# EAGLE design Keypads (EAGLE 9.5.2)
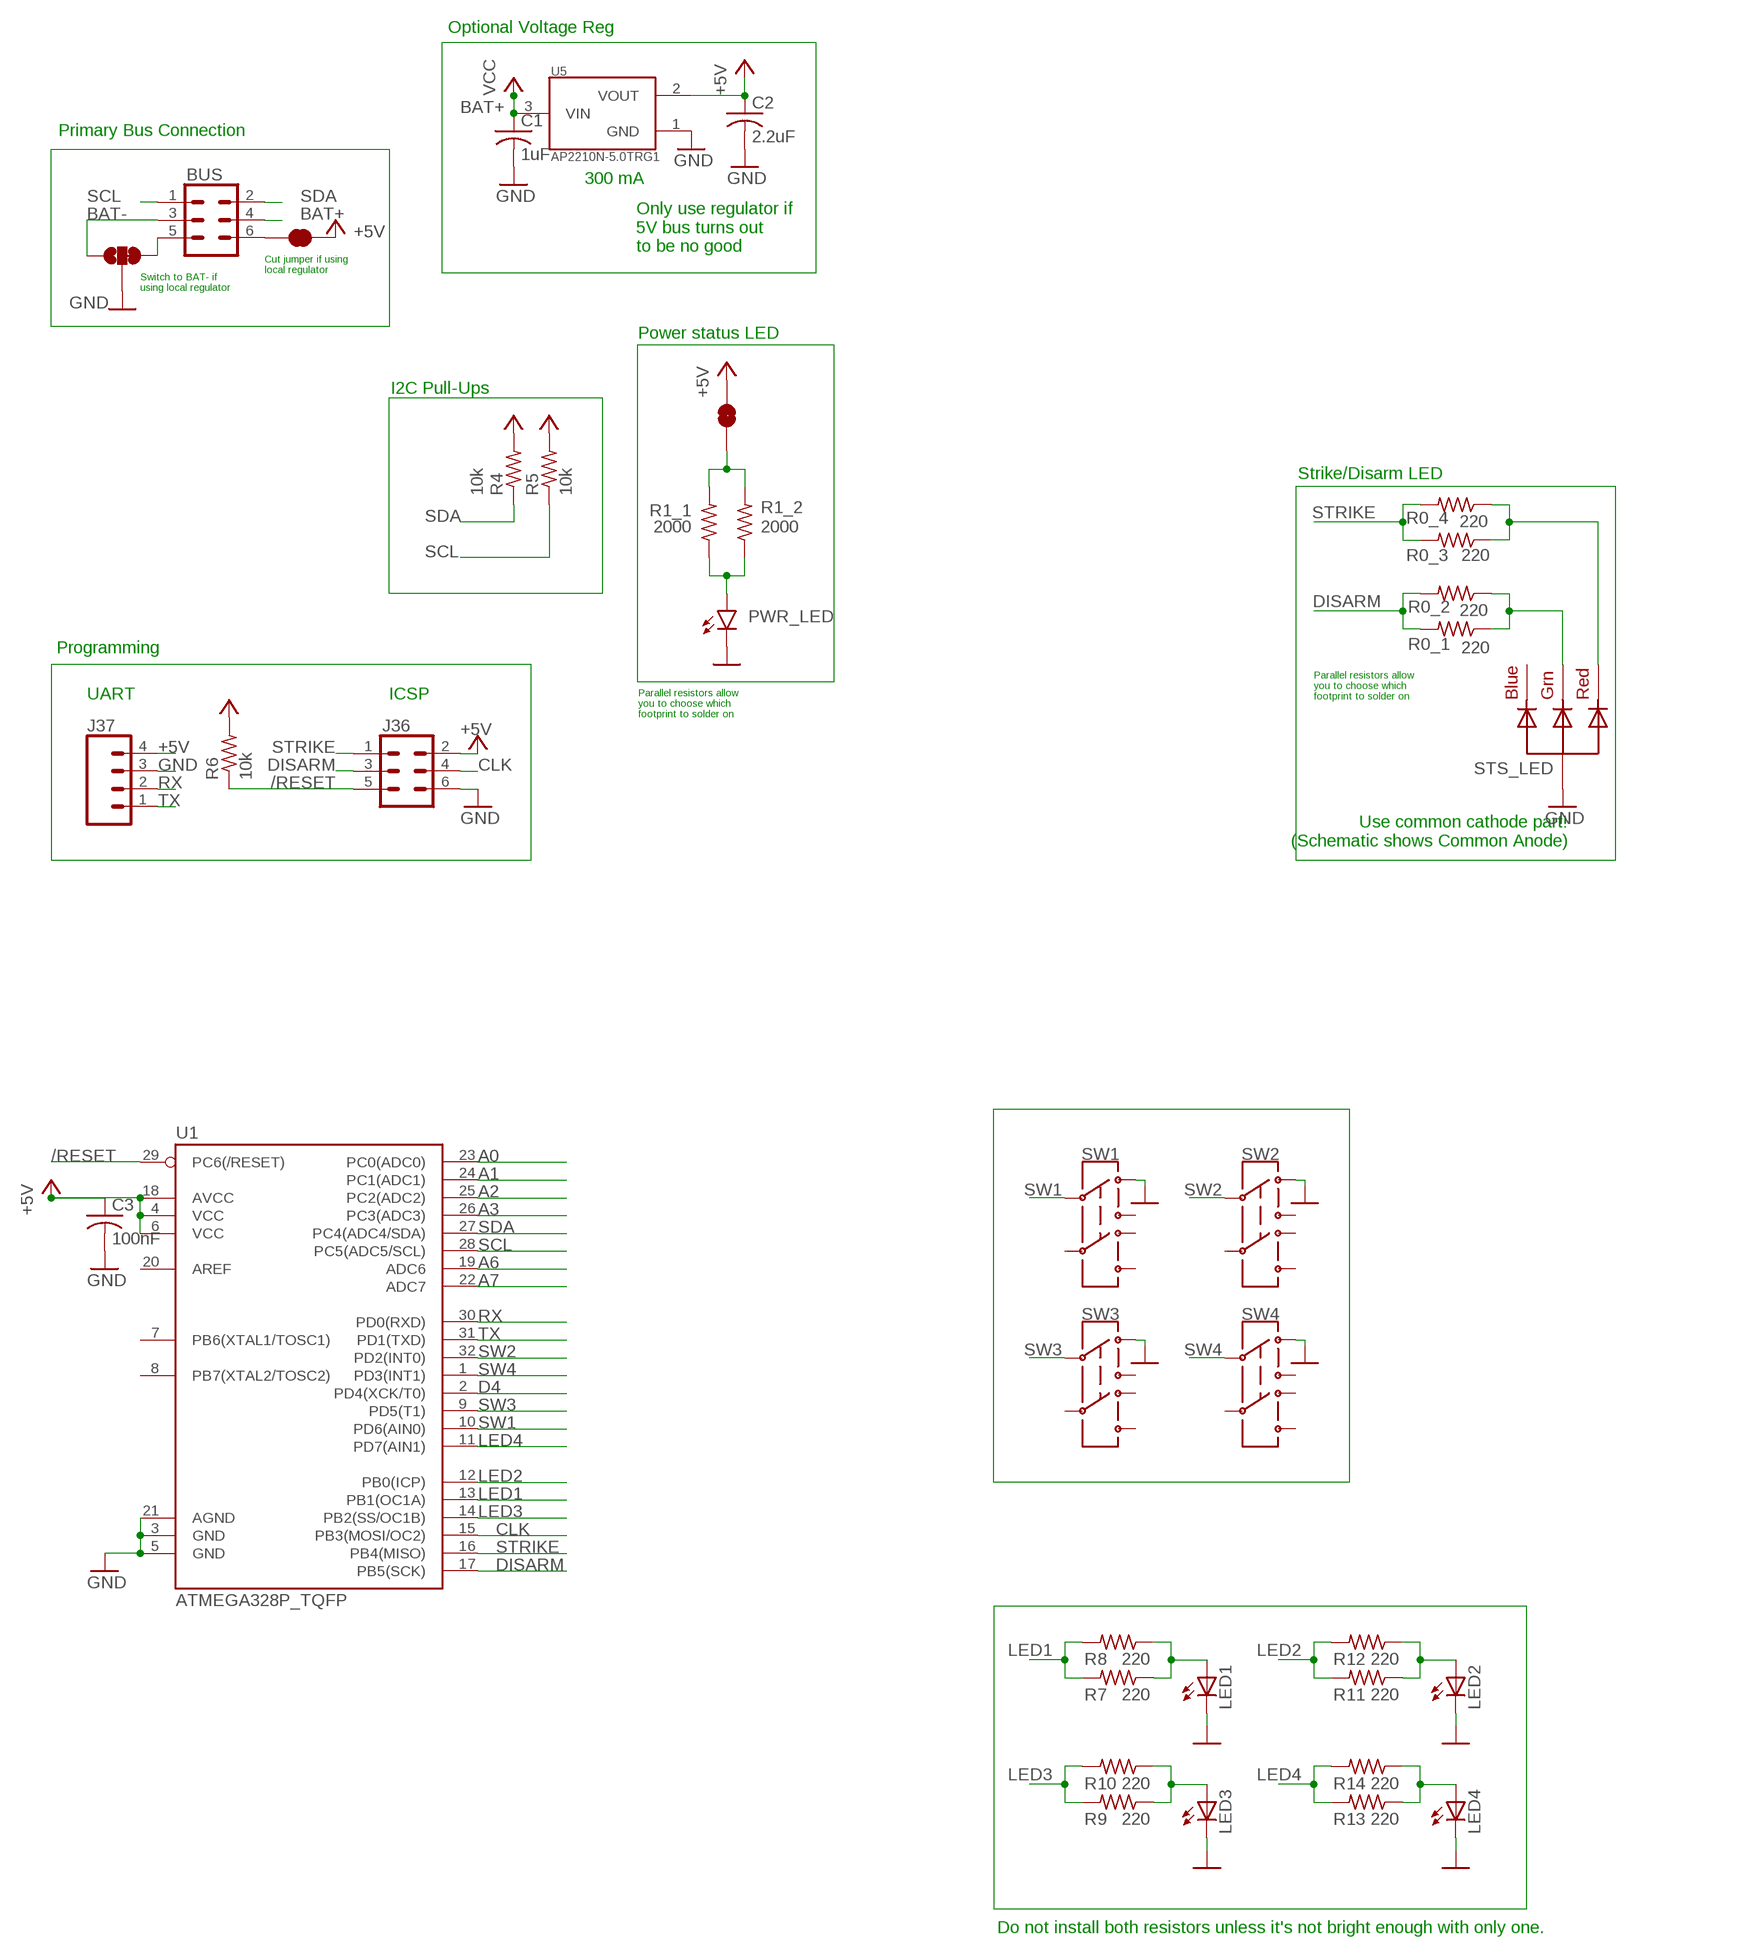
[diagram p0: schematic, sheet 1]

## Parts
BUS  CONN_03X2SHROUD  [2X3-SHROUDED]
C1  1uF  C-USC0805  [C0805]
C2  2.2uF  C-USC0805  [C0805]
C3  100nF  C-USC0805  [C0805]
J36  CONN_03X22X3_SILK_MALE_PTH  [2X3]
J37  CONN_04  [1X04]
JP1  JUMPER-SMT_2_NC_TRACE_SILK  [SMT-JUMPER_2_NC_TRACE_SILK]
JP2  JUMPER-SMT_3_1-NC_TRACE_SILK  [SMT-JUMPER_3_1-NC_TRACE_SILK]
JP3  JUMPER-SMT_2_NC_TRACE_SILK  [SMT-JUMPER_2_NC_TRACE_SILK]
LED1  LEDCHIP-LED0603  [CHIP-LED0603]
LED2  LEDCHIP-LED0603  [CHIP-LED0603]
LED3  LEDCHIP-LED0603  [CHIP-LED0603]
LED4  LEDCHIP-LED0603  [CHIP-LED0603]
PWR_LED  LED3MM  [LED_3MM]
R0_1  220  R-US_0204/7  [0204/7]
R0_2  220  R-US_R0805  [R0805]
R0_3  220  R-US_0204/7  [0204/7]
R0_4  220  R-US_R0805  [R0805]
R1_1  2000  R-US_0204/7  [0204/7]
R1_2  2000  R-US_R0805  [R0805]
R4  10k  R-US_0204/7  [0204/7]
R5  10k  R-US_0204/7  [0204/7]
R6  10k  R-US_0204/7  [0204/7]
R7  220  R-US_R0805  [R0805]
R8  220  R-US_R0805  [R0805]
R9  220  R-US_R0805  [R0805]
R10  220  R-US_R0805  [R0805]
R11  220  R-US_R0805  [R0805]
R12  220  R-US_R0805  [R0805]
R13  220  R-US_R0805  [R0805]
R14  220  R-US_R0805  [R0805]
STS_LED  RGBLED_CA-5MM  [LED5MMRGB]
SW1  MHPS2283N-SWITCH-PUSH-DPDT  [MHPS2283N]
SW2  MHPS2283N-SWITCH-PUSH-DPDT  [MHPS2283N]
SW3  MHPS2283N-SWITCH-PUSH-DPDT  [MHPS2283N]
SW4  MHPS2283N-SWITCH-PUSH-DPDT  [MHPS2283N]
U1  ATMEGA328P_TQFP  [TQFP32-08]
U5  AP2210N-5.0TRG1  [SOT95P280X145-3N]

## Nets
+5V: C2.1 C3.1 J36.2 J37.4 JP1.2 JP3.2 R4.2 R5.2 R6.2 U1.4(VCC) U1.6(VCC) U1.18(AVCC) U5.2(VOUT)
/RESET: J36.5 R6.1 U1.29(PC6(/RESET))
A0: U1.23(PC0(ADC0))
A1: U1.24(PC1(ADC1))
A2: U1.25(PC2(ADC2))
A3: U1.26(PC3(ADC3))
A6: U1.19(ADC6)
A7: U1.22(ADC7)
BAT+: BUS.4 C1.1 U5.3(VIN) ; supply symbol labelled VCC
BAT-: BUS.3 JP2.1
CLK: J36.4 U1.15(PB3(MOSI/OC2))
CONN_5V: BUS.6 JP1.1
CONN_GND: BUS.5 JP2.3
D4: U1.2(PD4(XCK/T0))
DISARM: J36.3 R0_1.2 R0_2.2 U1.17(PB5(SCK))
GND: C1.2 C2.2 C3.2 J36.6 J37.3 JP2.2 LED1.C LED2.C LED3.C LED4.C PWR_LED.K(C) STS_LED.2(VCC) SW1.P$1 SW2.P$1 SW3.P$1 SW4.P$1 U1.3(GND) U1.5(GND) U1.21(AGND) U5.1(GND)
LED1: R7.2 R8.2 U1.13(PB1(OC1A))
LED2: R11.2 R12.2 U1.12(PB0(ICP))
LED3: R9.2 R10.2 U1.14(PB2(SS/OC1B))
LED4: R13.2 R14.2 U1.11(PD7(AIN1))
N$2: PWR_LED.A R1_1.1 R1_2.1
N$3: JP3.1 R1_1.2 R1_2.2
N$5: LED3.A R9.1 R10.1
N$6: LED1.A R7.1 R8.1
N$7: LED2.A R11.1 R12.1
N$8: LED4.A R13.1 R14.1
N$11: R0_1.1 R0_2.1 STS_LED.3(GREEN)
N$12: R0_3.1 R0_4.1 STS_LED.1(RED)
RX: J37.2 U1.30(PD0(RXD))
SCL: BUS.1 R5.1 U1.28(PC5(ADC5/SCL))
SDA: BUS.2 R4.1 U1.27(PC4(ADC4/SDA))
STRIKE: J36.1 R0_3.2 R0_4.2 U1.16(PB4(MISO))
SW1: SW1.P$2 U1.10(PD6(AIN0))
SW2: SW2.P$2 U1.32(PD2(INT0))
SW3: SW3.P$2 U1.9(PD5(T1))
SW4: SW4.P$2 U1.1(PD3(INT1))
TX: J37.1 U1.31(PD1(TXD))
Unconnected: STS_LED.4(BLUE) SW1.P$3 SW1.P$4 SW1.P$5 SW1.P$6 SW2.P$3 SW2.P$4 SW2.P$5 SW2.P$6 SW3.P$3 SW3.P$4 SW3.P$5 SW3.P$6 SW4.P$3 SW4.P$4 SW4.P$5 SW4.P$6 U1.7(PB6(XTAL1/TOSC1)) U1.8(PB7(XTAL2/TOSC2)) U1.20(AREF)

## Notes on the sheet
- Optional Voltage Reg
- Primary Bus Connection
- 300 mA
- Only use regulator if 
  5V bus turns out 
  to be no good
- Cut jumper if using
  local regulator
- Switch to BAT- if
  using local regulator
- Power status LED
- I2C Pull-Ups
- Strike/Disarm LED
- Programming
- UART | ICSP
- Parallel resistors allow
  you to choose which
  footprint to solder on
- Parallel resistors allow
  you to choose which
  footprint to solder on
- Use common cathode part!
  (Schematic shows Common Anode)
- Do not install both resistors unless it's not bright enough with only one.

## Library data of the parts
BUS = SparkFun-Connectors:CONN_03X2: Multi connection point. Often used as Generic Header-pin footprint for 0.1 inch spaced/style header connections You can populate with any combo of single row headers, but if you'd like an exact match, check these: Header - 2x3 (Male, 0.1") <https://www.sparkfun.com/products/12807> (PRT-12807) Header - 2x3 (Female, 0.1") <https://www.sparkfun.com/products/13010> (PRT-13010) 2x3 Pin Shrouded Header <https://www.sparkfun.com/products/10877> (PRT-10877) On any of the 0.1 inch spaced packages, you can populate with these: Break Away Headers - Straight <https://www.sparkfun.com/products/116> (PRT-00116) Break Away Male Headers - Right Angle <https://www.sparkfun.com/products/553> (PRT-00553) Female Headers <https://www.sparkfun.com/products/115> (PRT-00115) Break Away Headers - Machine Pin <https://www.sparkfun.com/products/117> (PRT-00117) Break Away Female Headers - Swiss Machine Pin <https://www.sparkfun.com/products/743> (PRT-00743) Special note: the shrouded connector mates well with our 3x2 ribbon cables: Ribbon Crimp Connector - 6-pin (2x3, Female) <https://www.sparkfun.com/products/10651> (PRT-10651) Ribbon Cable - 6 wire (15ft) <https://www.sparkfun.com/products/10646> (PRT-10646); PROD_ID: CONN-10681; SF_ID: PRT_10877
C1-C3 = adafruit:C-US: CAPACITOR, American symbol
J36 = SparkFun-Connectors:CONN_03X2: Multi connection point. Often used as Generic Header-pin footprint for 0.1 inch spaced/style header connections You can populate with any combo of single row headers, but if you'd like an exact match, check these: Header - 2x3 (Male, 0.1") <https://www.sparkfun.com/products/12807> (PRT-12807) Header - 2x3 (Female, 0.1") <https://www.sparkfun.com/products/13010> (PRT-13010) 2x3 Pin Shrouded Header <https://www.sparkfun.com/products/10877> (PRT-10877) On any of the 0.1 inch spaced packages, you can populate with these: Break Away Headers - Straight <https://www.sparkfun.com/products/116> (PRT-00116) Break Away Male Headers - Right Angle <https://www.sparkfun.com/products/553> (PRT-00553) Female Headers <https://www.sparkfun.com/products/115> (PRT-00115) Break Away Headers - Machine Pin <https://www.sparkfun.com/products/117> (PRT-00117) Break Away Female Headers - Swiss Machine Pin <https://www.sparkfun.com/products/743> (PRT-00743) Special note: the shrouded connector mates well with our 3x2 ribbon cables: Ribbon Crimp Connector - 6-pin (2x3, Female) <https://www.sparkfun.com/products/10651> (PRT-10651) Ribbon Cable - 6 wire (15ft) <https://www.sparkfun.com/products/10646> (PRT-10646); PROD_ID: CONN-09701
J37 = SparkFun-Connectors:CONN_04: Multi connection point. Often used as Generic Header-pin footprint for 0.1 inch spaced/style header connections On any of the 0.1 inch spaced packages, you can populate with these: Break Away Headers - Straight <https://www.sparkfun.com/products/116> (PRT-00116) Break Away Male Headers - Right Angle <https://www.sparkfun.com/products/553> (PRT-00553) Female Headers <https://www.sparkfun.com/products/115> (PRT-00115) Break Away Headers - Machine Pin <https://www.sparkfun.com/products/117> (PRT-00117) Break Away Female Headers - Swiss Machine Pin <https://www.sparkfun.com/products/743> (PRT-00743) For SCREWTERMINALS and SPRING TERMINALS visit here: Screw Terimnals on SparkFun.com <https://www.sparkfun.com/search/results?term=Screw+Terminals> (5mm/3.5mm/2.54mm spacing) This device is also useful as a general connection point to wire up your design to another part of your project. Our various solder wires solder well into these plated through hole pads. Hook-Up Wire - Assortment (Stranded, 22 AWG) <https://www.sparkfun.com/products/11375> (PRT-11375) Hook-Up Wire - Assortment (Solid Core, 22 AWG) <https://www.sparkfun.com/products/11367> (PRT-11367) View the entire wire category on our website here <https://www.sparkfun.com/categories/141> Special notes: Molex polarized connector foot print use with SKU : PRT-08231 with associated crimp pins and housings. 1MM SMD Version SKU: PRT-10208; PROD_ID: CONN-09696
JP1 JP3 = SparkFun-Jumpers:JUMPER-SMT_2_NC_TRACE: Normally closed trace jumper This jumper has a trace between two pads so it's normally closed (NC). Use a razor knife to open the connection. For best results follow the IPC guidelines for cutting traces: Cutout at least 0.063 mm (0.005 in). Remove all loose material to clean up the cut area. Seal the cut with an approved epoxy. Reapply solder to reclose the connection.
JP2 = SparkFun-Jumpers:JUMPER-SMT_3_1-NC_TRACE: Normally closed trace jumper (1 of 2 connections) This jumper has a trace between two pads so it's normally closed (NC). The other connection is normally open (NO). Use a razor knife to open the connection. For best results follow the IPC guidelines for cutting traces: Cutout at least 0.063 mm (0.005 in). Remove all loose material to clean up the cut area. Seal the cut with an approved epoxy. Reapply solder to reclose the connection, or to close the NO connection.
LED1-LED4 = adafruit:LED: LED OSRAM: - CHIPLED LG R971, LG N971, LY N971, LG Q971, LY Q971, LO R971, LY R971 LH N974, LH R974 LS Q976, LO Q976, LY Q976 LO Q996 - Hyper CHIPLED LW Q18S LB Q993, LB Q99A, LB R99A - SideLED LS A670, LO A670, LY A670, LG A670, LP A670 LB A673, LV A673, LT A673, LW A673 LH A674 LY A675 LS A676, LA A676, LO A676, LY A676, LW A676 LS A679, LY A679, LG A679 - Hyper Micro SIDELED® LS Y876, LA Y876, LO Y876, LY Y876 LT Y87S - SmartLED LW L88C, LW L88S LB L89C, LB L89S, LG L890 LS L89K, LO L89K, LY L89K LS L896, LA L896, LO L896, LY L896 - TOPLED LS T670, LO T670, LY T670, LG T670, LP T670 LSG T670, LSP T670, LSY T670, LOP T670, LYG T670 LG T671, LOG T671, LSG T671 LB T673, LV T673, LT T673, LW T673 LH T674 LS T676, LA T676, LO T676, LY T676, LB T676, LH T676, LSB T676, LW T676 LB T67C, LV T67C, LT T67C, LS T67K, LO T67K, LY T67K, LW E67C LS E67B, LA E67B, LO E67B, LY E67B, LB E67C, LV E67C, LT E67C LW T67C LS T679, LY T679, LG T679 LS T770, LO T770, LY T770, LG T770, LP T770 LB T773, LV T773, LT T773, LW T773 LH T774 LS E675, LA E675, LY E675, LS T675 LS T776, LA T776, LO T776, LY T776, LB T776 LHGB T686 LT T68C, LB T68C - Hyper Mini TOPLED® LB M676 - Mini TOPLED Santana® LG M470 LS M47K, LO M47K, LY M47K Source: http://www.osram.convergy.de/
PWR_LED = SparkFun-LED:LED: LED (Generic) Standard schematic elements and footprints for 5mm, 3mm, 1206, and 0603 sized LEDs. Generic LEDs with no color specified.; PROD_ID: DIO-08794
R0_1-R0_4 R1_1 R1_2 R4-R14 = adafruit:R-US_: RESISTOR, American symbol
STS_LED = adafruit:RGBLED_CA: RGB LED, common-anode 5MM Staggered pins 5mm Piranha package http://www.ladyada.net/library/pcb/eaglelibrary.html
SW1-SW4 = MyLibrary:MHPS2283N-SWITCH-PUSH-DPDT
U1 = SparkFun-IC-Microcontroller:ATMEGA328P_TQFP: Popular 328P in QFP Storefront component: ATmega328 - TQFP <https://www.sparkfun.com/products/13448> (COM-13448) Datasheet <http://www.sparkfun.com/datasheets/Components/SMD/ATMega328.pdf> SparkFun Products SparkFun RedBoard - Programmed with Arduino <https://www.sparkfun.com/products/12757> (DEV-12757) Arduino Pro Mini 328 - 5V/16MHz <https://www.sparkfun.com/products/11113> (DEV-11113) Arduino Pro Mini 328 - 3.3V/8MHz <https://www.sparkfun.com/products/11114> (DEV-11114) SparkFun OpenLog <https://www.sparkfun.com/products/13712> (DEV-13712) SparkFun MicroView - OLED Arduino Module <https://www.sparkfun.com/products/12923> (DEV-12923) SparkFun Digital Sandbox <https://www.sparkfun.com/products/12651> (DEV-12651) SparkFun PicoBoard <https://www.sparkfun.com/products/11888> (WIG-11888) Arduino Fio <https://www.sparkfun.com/products/10116> (DEV-10116) LilyPad Arduino 328 Main Board <https://www.sparkfun.com/products/13342> (DEV-13342) SparkFun RedStick <https://www.sparkfun.com/products/13741> (DEV-13741) LilyPad MP3 <https://www.sparkfun.com/products/11013> (DEV-11013) LilyPad Arduino SimpleSnap <https://www.sparkfun.com/products/10941> (DEV-10941) SparkFun Stepoko <https://www.sparkfun.com/products/13899> (ROB-13899) SparkFun Geiger Counter <https://www.sparkfun.com/products/11345> (SEN-11345) SparkFun EL Sequencer <https://www.sparkfun.com/products/12781> (COM-12781) Arduino Pro 328 - 5V/16MHz <https://www.sparkfun.com/products/10915> (DEV-10915) CryptoCape <https://www.sparkfun.com/products/12773> (DEV-12773) SparkFun IR Thermometer Evaluation Board - MLX90614 <https://www.sparkfun.com/products/10740> (SEN-10740) SparkFun RedBot Mainboard <https://www.sparkfun.com/products/12097> (ROB-12097) Arduino Pro 328 - 3.3V/8MHz <https://www.sparkfun.com/products/10914> (DEV-10914) SparkFun Block for Intel® Edison - Arduino <https://www.sparkfun.com/products/13036> (DEV-13036) SparkFun Simon Says - Surface Mount Soldering Kit <https://www.sparkfun.com/products/10935> (KIT-10935) SparkFun 7-Segment Serial Display - Red <https://www.sparkfun.com/products/11441> (COM-11441) SparkFun 7-Segment Serial Display - White <https://www.sparkfun.com/products/11629> (COM-11629) SparkFun 7-Segment Serial Display - Yellow <https://www.sparkfun.com/products/11443> (COM-11443) SparkFun 7-Segment Serial Display - Kelly Green <https://www.sparkfun.com/products/11440> (COM-11440) SparkFun 7-Segment Serial Display - Blue <https://www.sparkfun.com/products/11442> (COM-11442) SparkFun OpenSegment Serial Display - 20mm (Blue) <https://www.sparkfun.com/products/11647> (COM-11647) SparkFun OpenSegment Serial Display - 20mm (Green) <https://www.sparkfun.com/products/11646> (COM-11646) SparkFun OpenSegment Serial Display - 20mm (White) <https://www.sparkfun.com/products/11648> (COM-11648) SparkFun OpenSegment Serial Display - 20mm (Red) <https://www.sparkfun.com/products/11644> (COM-11644) SparkFun OpenSegment Serial Display - 20mm (Yellow) <https://www.sparkfun.com/products/11645> (COM-11645) SparkFun OpenSegment Shield <https://www.sparkfun.com/products/13190> (DEV-13190); PROD_ID: IC-09069
U5 = AP2210N-5.0TRG1:AP2210N-5.0TRG1: LDO Regulator Pos 5V 0.3A 3-Pin SOT-23 T/R; DESCRIPTION: Linear Voltage Regulator IC 1 Output 300mA SOT-23-3; DIGI-KEY_PART_NUMBER: AP2210N-5.0TRG1DICT-ND; MF: Diodes Inc.; MP: AP2210N-5.0TRG1; PACKAGE: SOT-23 Diodes Inc.; PURCHASE-URL: https://pricing.snapeda.com/search/part/AP2210N-5.0TRG1/?ref=eda

## Board
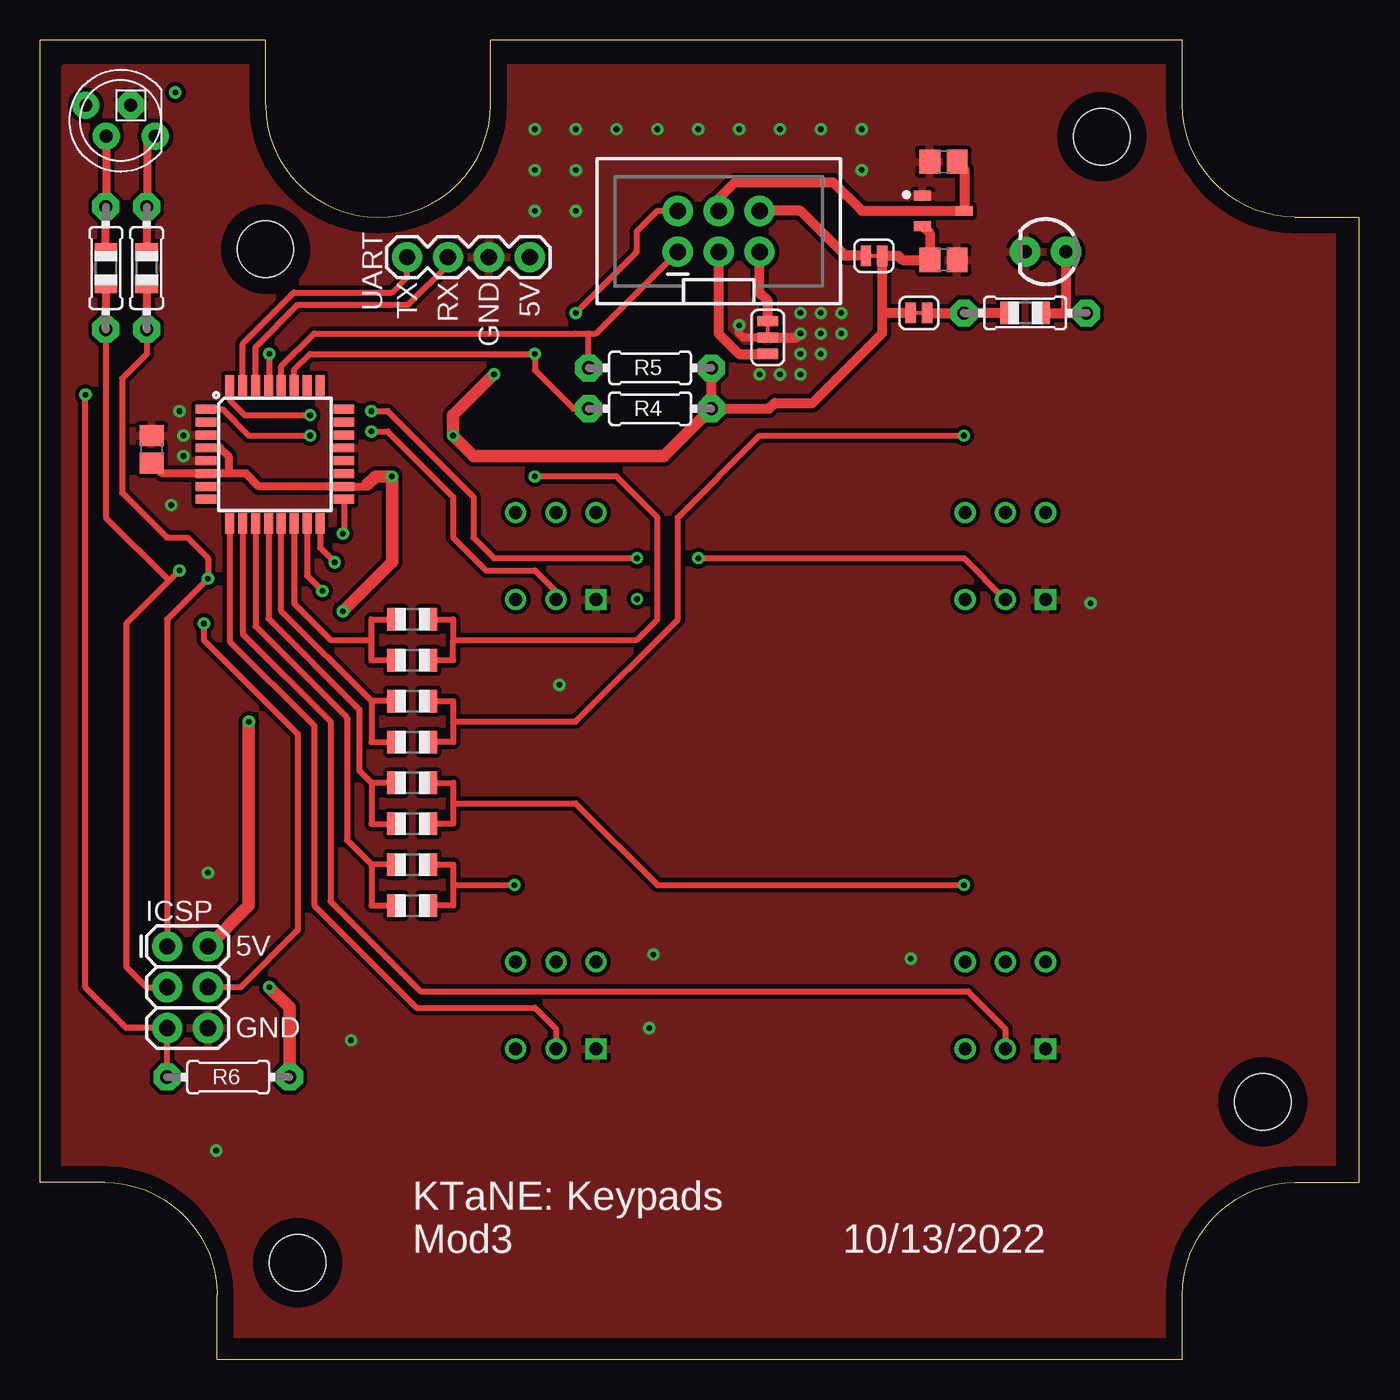
[diagram p1: board, top side]
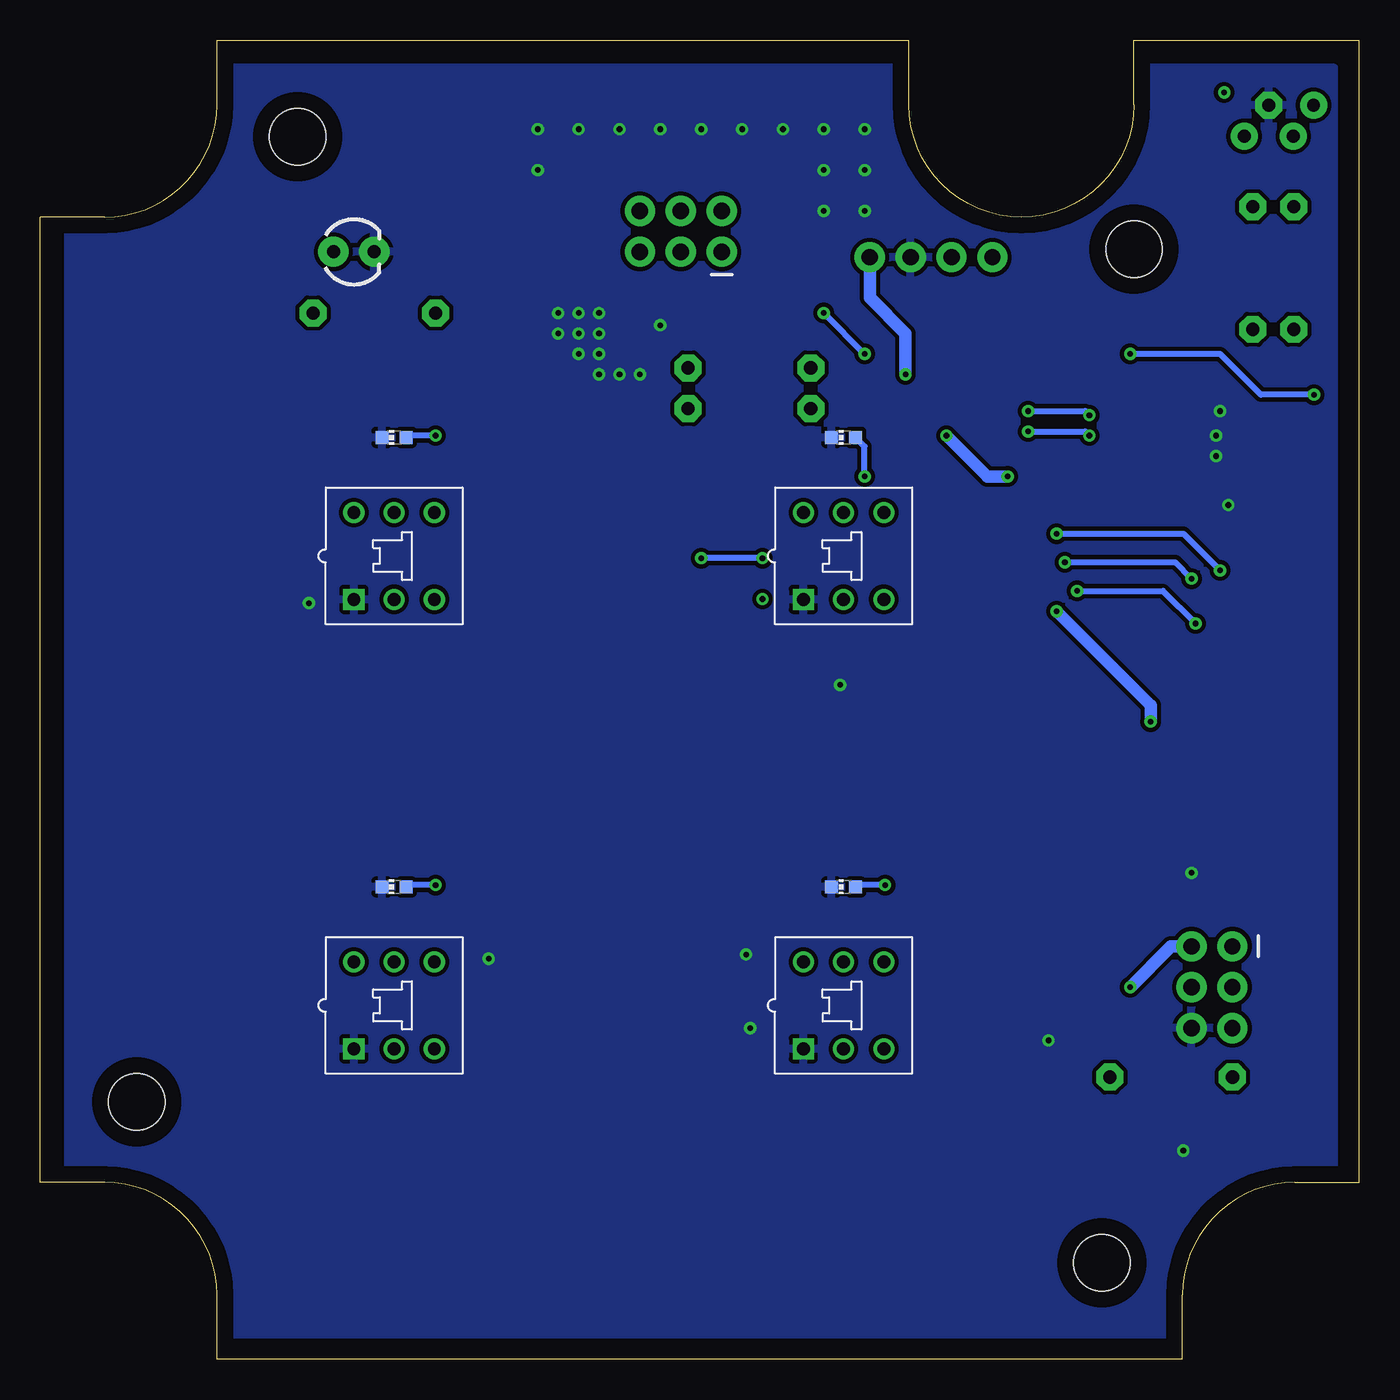
[diagram p2: board, bottom side, seen from below]

Size 82 x 82 mm. Coordinates in mm from the lower left corner, seen from the top.
Outline: 82,11 82,71 78,71 arc-90 71,78 71,82 28,82 28,78 arc-180 14,78 14,82 0,82 0,11 4,11 arc-90 11,4 11,0 71,0 71,4 arc-90 78,11 82,11
Copper layers (1*16): Top 0.035mm / dielectric 1.5mm / Bottom 0.035mm
Design rules "default *": minimum track width 6mil, minimum drill 0.35mm, track to track 6mil, track to pad 6mil, pad to pad 6mil, via to via 6mil, smd to smd 6mil, copper to edge 40mil, drill to drill 6mil, minimum pad ring 10mil, minimum via ring 8mil, stop-mask expansion 4mil, vias tented up to drill 0mil, thermal gap 10mil
Holes 3.5 mm at 16,6 76,16 66,76 14,69

### Footprints (pad centres in the part's own frame; a part is rotated, then mirrored left to right if it is on the bottom)
2X3-SHROUDED = drill 1.016 pad 1.88: 1 -1.27,2.54; 2 1.27,2.54; 3 -1.27,0; 4 1.27,0; 5 -1.27,-2.54; 6 1.27,-2.54
C0805 = smd 1.3 x 1.5: 1 -0.85,0; 2 0.85,0
2X3 = drill 1.016 pad 1.88: 1 0,0; 2 0,2.54; 3 2.54,0; 4 2.54,2.54; 5 5.08,0; 6 5.08,2.54
1X04 = drill 1.016 pad 1.88: 1 0,0; 2 2.54,0; 3 5.08,0; 4 7.62,0
SMT-JUMPER_2_NC_TRACE_SILK = smd 0.635 x 1.27: 1 -0.508,0; 2 0.508,0
SMT-JUMPER_3_1-NC_TRACE_SILK = smd 0.635 x 1.27: 1 -1.016,0; 2 0,0; 3 1.016,0
CHIP-LED0603 = smd 0.8 x 0.8: A 0,-0.75; C 0,0.75
LED_3MM = drill 0.813 pad 1.88: A -1.27,0; K 1.27,0
0204/7 = drill 0.813 pad 1.676 octagon: 1 -3.81,0; 2 3.81,0
R0805 = smd 1.1 x 1.4: 1 -1,0; 2 1,0
LED5MMRGB = drill 0.8 pad 1.676: 1 -2.159,0.968; 3 0.889,0.968; 4 2.159,-0.968 | drill 0.8 pad 1.676 octagon: 2 -0.635,-0.968
MHPS2283N = drill 0.8 square: P$1 -2.5,-2.7 | drill 0.8: P$2 0,-2.7; P$3 2.5,-2.7; P$4 2.5,2.7; P$5 0,2.7; P$6 -2.5,2.7
TQFP32-08 = smd 1.27 x 0.559: 1 -4.293,2.8; 2 -4.293,2; 3 -4.293,1.2; 4 -4.293,0.4; 5 -4.293,-0.4; 6 -4.293,-1.2; 7 -4.293,-2; 8 -4.293,-2.8; 17 4.293,-2.8; 18 4.293,-2; 19 4.293,-1.2; 20 4.293,-0.4; 21 4.293,0.4; 22 4.293,1.2; 23 4.293,2; 24 4.293,2.8 | smd 0.559 x 1.27: 9 -2.8,-4.293; 10 -2,-4.293; 11 -1.2,-4.293; 12 -0.4,-4.293; 13 0.4,-4.293; 14 1.2,-4.293; 15 2,-4.293; 16 2.8,-4.293; 25 2.8,4.293; 26 2,4.293; 27 1.2,4.293; 28 0.4,4.293; 29 -0.4,4.293; 30 -1.2,4.293; 31 -2,4.293; 32 -2.8,4.293
SOT95P280X145-3N = smd 1.05 x 0.6: 1 -1.3,0.95; 2 -1.3,-0.95; 3 1.3,0

### Placement (x,y rotation side)
BUS  42.18,70.12 90 top
C1  56.15,74.44 180 top
C2  56.15,68.34 0 top
C3  6.93,56.57 90 top
J36  7.89,25.67 270 top
J37  22.81,68.51 0 top
JP1  51.83,68.6 0 top
JP2  45.23,63.52 90 top
JP3  54.63,65.04 180 top
LED1  60,57.31 90 bottom
LED2  60,29.37 90 bottom
LED3  32.06,57.31 90 bottom
LED4  32.06,29.37 90 bottom
PWR_LED  62.5,68.85 180 top
R0_1  4.08,67.83 270 top
R0_2  4.08,67.83 270 top
R0_3  6.62,67.83 270 top
R0_4  6.62,67.83 270 top
R1_1  61.23,65.04 180 top
R1_2  61.23,65.04 180 top
R4  37.91,59.09 0 top
R5  37.91,61.63 0 top
R6  11.69,17.54 0 top
R7  23.13,38.37 180 top
R8  23.13,40.91 180 top
R9  23.13,45.99 180 top
R10  23.13,43.45 180 top
R11  23.13,35.83 180 top
R12  23.13,33.29 180 top
R13  23.13,28.21 180 top
R14  23.13,30.75 180 top
STS_LED  5,77 180 top
SW1  60,22 0 bottom
SW2  60,49.94 0 bottom
SW3  32.06,22 0 bottom
SW4  32.06,49.94 0 bottom
U1  14.59,56.26 0 top
U5  56.15,71.39 0 top

### Tracks (layer width: path | path; a pad name or v marks a point on that pad's centre or on a via)
+5V  (via drill 0.35)
  Top 0.508: 20.34,54.37 20.22,54.26 U1.18 13.59,54.26 12.79,55.06 11.7,55.06 | 11.7,55.06 U1.6 7.58,55.06 C3.1 | U1.4 11.19,56.66 11.7,56.15 11.7,55.06
  Top 0.635: 52.34,65.04 JP1.2 53.36,68.6 53.61,68.34 C2.1 55.3,69.99 U5.2 | 52.34,65.04 52.34,63.77 48.02,59.45 45.68,59.45 45.31,59.09 R4.2 R5.2 | JP3.2 52.34,65.04
  Top 0.762: R4.2 38.78,56.15 26.94,56.15 v25.67,57.42 25.67,58.69 v28.21,61.23 | 20.34,54.37 20.84,54.88 v21.86,54.88 21.86,49.55 v18.81,46.5 | v12.97,39.64 12.97,28.21 J36.2 | v14.24,23.13 15.5,21.87 R6.2
  Bottom 0.762: v25.67,57.42 23.13,54.88 v21.86,54.88 | v18.81,46.5 12.97,40.66 v12.97,39.64 | J36.2 11.7,25.67 v14.24,23.13 | v28.21,61.23 28.21,63.77 30.43,65.99 J37.4
/RESET  (via drill 0.35)
  Top 0.381: R6.1 J36.5 5.35,20.59 2.81,23.13 v2.81,59.96 | v14.24,62.5 14.24,60.6 U1.29
  Bottom 0.381: v2.81,59.96 6.11,59.96 8.65,62.5 v14.24,62.5
BAT+
  Top 0.635: BUS.4 42.18,72.15 43.2,73.17 49.29,73.17 51.07,71.39 U5.3 57.45,73.99 C1.1
BAT-
  Top 0.635: JP2.1 43.45,62.5 42.18,63.77 BUS.3
CLK  (via drill 0.35)
  Top 0.381: U1.15 16.59,48.72 v17.54,47.77 | v10.18,45.74 10.18,44.72 16.02,38.88 16.02,26.69 12.46,23.13 J36.4
  Bottom 0.381: v17.54,47.77 12.21,47.77 v10.18,45.74
CONN_5V
  Top 0.635: JP1.1 50.05,68.6 47.26,71.39 BUS.6
CONN_GND
  Top 0.635: JP2.3 45.23,65.8 44.72,66.31 BUS.5
DISARM  (via drill 0.35)
  Top 0.381: U1.17 18.88,51.4 v18.81,51.32 | v8.65,49.04 8.02,48.4 | 8.02,48.4 5.35,45.74 5.35,24.4 6.62,23.13 J36.3 | R0_1.2 4.08,52.34 8.02,48.4
  Top 0.508: R0_2.2 R0_1.2
  Bottom 0.381: v18.81,51.32 10.94,51.32 v8.65,49.04
GND  (via drill 0.35)
  Top 0.508: JP2.2 43.7,63.52 43.45,63.77 v43.45,64.28
  Top 0.635: JP2.2 47.01,63.52 v47.26,63.77
  other vias: 8.65,58.94 8.91,57.42 8.91,56.15 47.26,65.04 48.53,65.04 49.8,65.04 49.8,63.77 48.53,63.77 48.53,62.5 47.26,62.5 47.26,61.23 45.99,61.23 44.72,61.23 33.29,71.39 30.75,71.39 30.75,73.93 33.29,73.93 30.75,76.47 33.29,76.47 35.83,76.47 38.37,76.47 40.91,76.47 43.45,76.47 45.99,76.47 48.53,76.47 51.07,76.47 51.07,73.93 8.14,53.1 10.43,30.24 19.32,19.83 10.94,12.97 37.86,20.59 38.12,25.16 54.12,24.91 65.29,47.01 32.27,41.93
  pour Bottom (isolate 0.254): 1.54,80.28 80.28,80.28 80.28,1.54 1.54,1.54
  pour Top (isolate 0.254): 1.54,80.28 80.28,80.28 80.28,1.54 1.54,1.54
LED1
  Top 0.381: R8.2 20.59,40.91 | 20.59,40.91 20.59,38.37 R7.2 | 20.59,40.91 14.99,46.51 U1.13
LED2
  Top 0.381: R11.2 20.59,35.83 | 20.59,35.83 20.59,33.29 R12.2 | U1.12 14.19,46.04 19.83,40.4 19.83,36.59 20.59,35.83
LED3
  Top 0.381: R10.2 20.59,43.45 20.59,44.72 | 20.59,44.72 20.59,45.99 R9.2 | U1.14 15.79,46.98 18.05,44.72 20.59,44.72
LED4
  Top 0.381: R14.2 20.59,30.75 | 20.59,30.75 20.59,28.21 R13.2 | U1.11 13.39,45.57 19.07,39.89 19.07,32.27 20.59,30.75
N$2
  Top 0.635: R1_2.1 63.77,65.04 | 63.77,65.04 R1_1.1 | PWR_LED.A 63.77,65.04
N$3
  Top 0.635: JP3.1 R1_1.2 R1_2.2
N$5  (via drill 0.35)
  Top 0.381: R9.1 25.67,45.99 25.67,44.72 | 25.67,44.72 25.67,43.45 R10.1 | v30.75,54.88 35.83,54.88 38.37,52.34 38.37,45.99 37.1,44.72 25.67,44.72
  Bottom 0.381: v30.75,54.88 30.75,56.75 LED3.A
N$6  (via drill 0.35)
  Top 0.381: R8.1 25.67,40.91 25.67,39.64 | 25.67,39.64 25.67,38.37 R7.1 | 25.67,39.64 33.29,39.64 39.64,45.99 39.64,52.34 44.72,57.42 v57.42,57.42
  Bottom 0.381: v57.42,57.42 59.14,57.42 LED1.A
N$7  (via drill 0.35)
  Top 0.381: R11.1 25.67,35.83 25.67,34.56 | 25.67,34.56 25.67,33.29 R12.1 | 25.67,34.56 33.29,34.56 38.37,29.48 v57.42,29.48
  Bottom 0.381: v57.42,29.48 59.14,29.48 LED2.A
N$8  (via drill 0.35)
  Top 0.381: R14.1 25.67,30.75 25.67,29.48 | 25.67,29.48 25.67,28.21 R13.1 | 25.67,29.48 v29.48,29.48
  Bottom 0.381: v29.48,29.48 31.2,29.48 LED4.A
N$11
  Top 0.508: STS_LED.3 4.11,71.67 R0_1.1 R0_2.1
N$12
  Top 0.508: STS_LED.1 6.65,75.52 6.65,71.67 R0_3.1 R0_4.1
N$21  (via drill 0.35)
  other vias: 37.1,47.26
N$35  (via drill 0.35)
  other vias: 8.4,78.76
RX
  Top 0.381: U1.30 13.39,62.92 16.02,65.55 22.88,65.55 25.35,68.02 J37.2
SCL
  Top 0.381: U1.28 14.99,61.73 17.03,63.77 33.29,63.77 34.1,63.77 | BUS.1 34.56,63.77 34.1,63.77 | R5.1 34.1,63.77
SDA  (via drill 0.35)
  Top 0.381: U1.27 15.79,61.51 16.78,62.5 v30.75,62.5 30.75,61.48 33.14,59.09 R4.1 | v33.29,65.04 37.1,68.85 37.1,70.12 38.37,71.39 BUS.2
  Bottom 0.381: v30.75,62.5 v33.29,65.04
STRIKE  (via drill 0.35)
  Top 0.381: U1.16 17.39,50.46 v18.3,49.55 | J36.1 7.89,45.99 v10.43,48.53 10.43,49.8 9.16,51.07 7.89,51.07 5.1,53.86 5.1,60.98 6.62,62.5 R0_3.2
  Top 0.508: R0_4.2 R0_3.2
  Bottom 0.381: v18.3,49.55 11.45,49.55 v10.43,48.53
SW1
  Top 0.381: U1.10 12.59,45.1 18.05,39.64 18.05,28.47 23.65,22.88 57.67,22.88 60,20.55 SW1.P$2
SW2  (via drill 0.35)
  Top 0.381: U1.32 11.79,59.62 12.72,58.69 v16.78,58.69 | v20.59,58.94 21.61,58.94 26.94,53.61 26.94,51.07 28.21,49.8 v37.1,49.8 | v40.91,49.8 57.42,49.8 59.98,47.24 SW2.P$2
  Bottom 0.381: v16.78,58.69 17.03,58.94 v20.59,58.94 | v37.1,49.8 v40.91,49.8
SW3
  Top 0.381: U1.9 11.79,44.63 17.03,39.39 17.03,28.21 23.38,21.86 30.75,21.86 32.06,20.55 SW3.P$2
SW4  (via drill 0.35)
  Top 0.381: U1.1 11.33,59.06 12.97,57.42 v16.78,57.42 | v20.59,57.67 21.61,57.67 25.67,53.61 25.67,51.07 27.7,49.04 30.75,49.04 32.06,47.73 SW4.P$2
  Bottom 0.381: v20.59,57.67 17.03,57.67 v16.78,57.42
TX
  Top 0.381: U1.31 12.59,63.14 15.76,66.31 21.86,66.31 22.81,67.26 J37.1

### Text on the board
tNames: TX | RX | GND | 5V | UART | ICSP | 5V | GND | KTaNE: Keypads / Mod3 | 10/13/2022